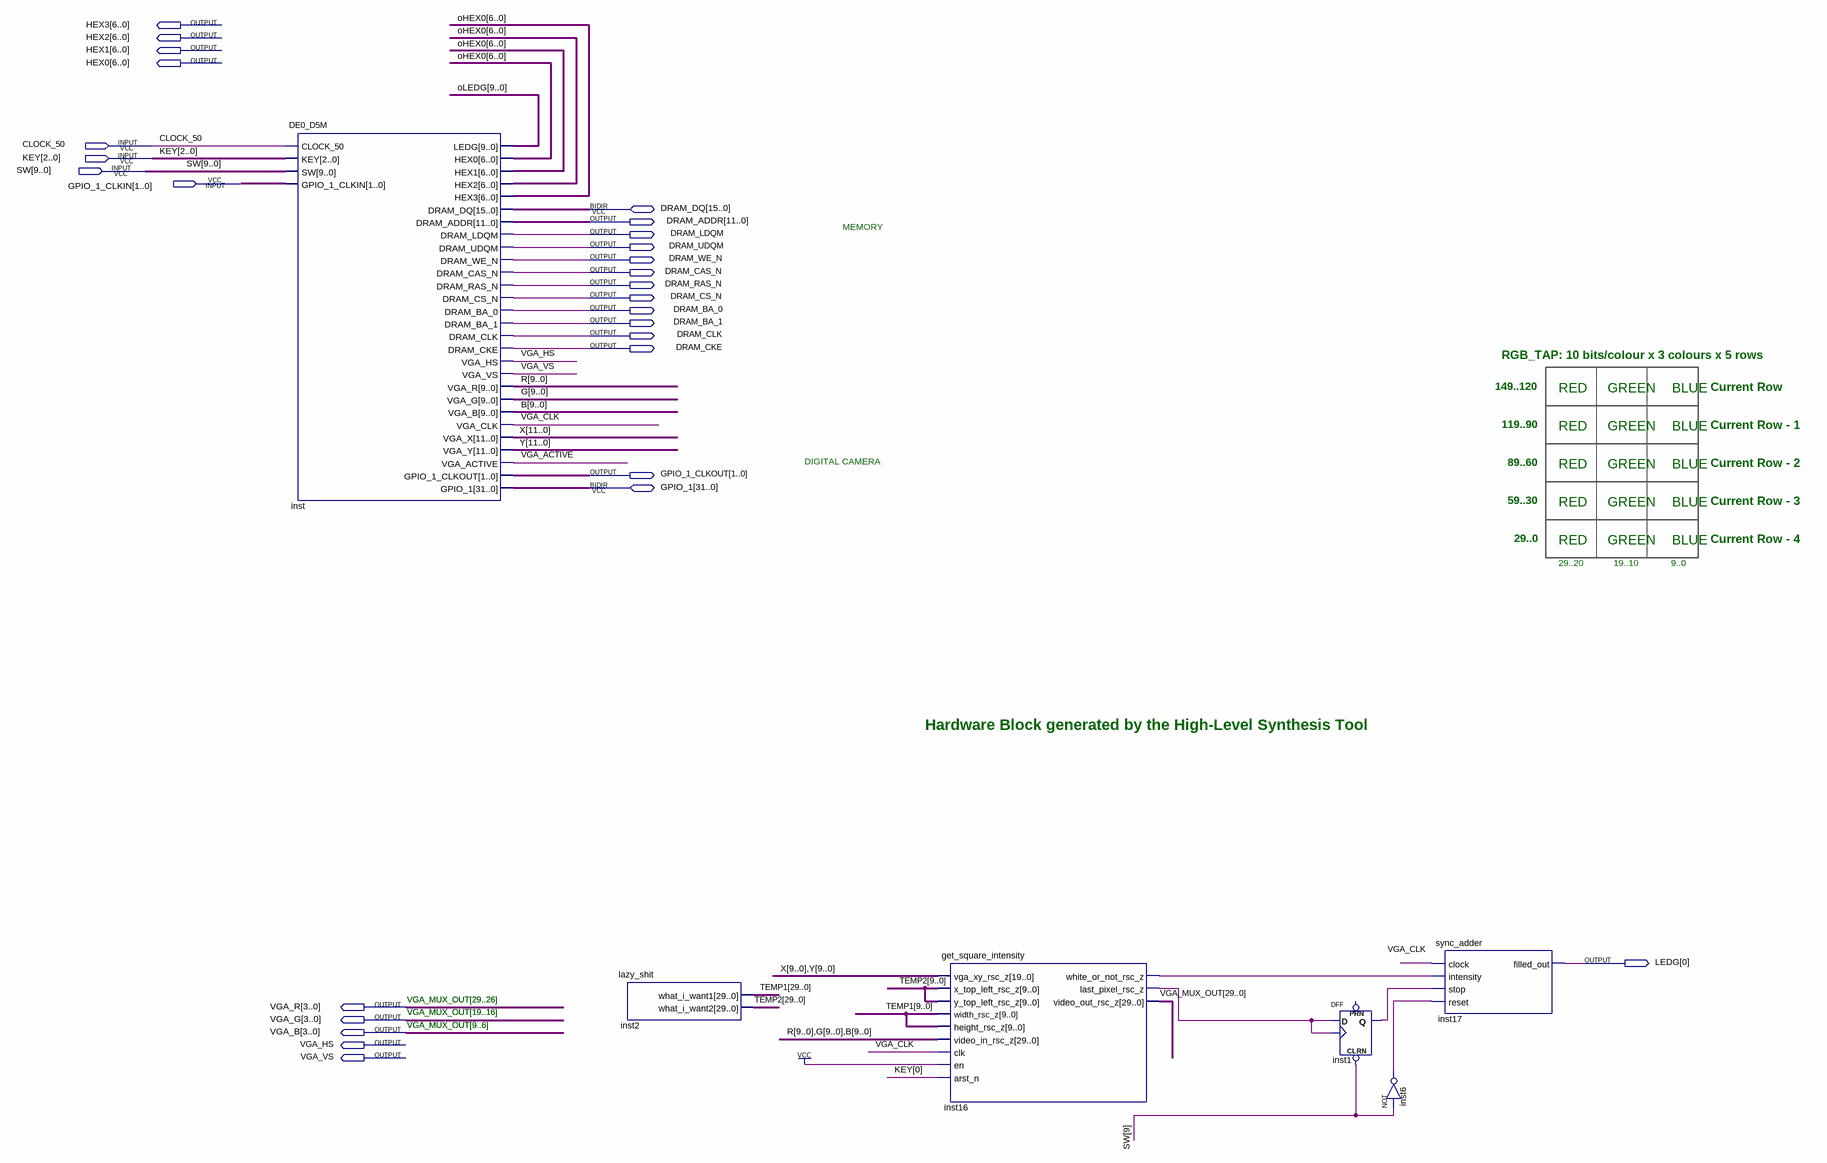
[diagram p0: schematic sheet]
// Quartus schematic TOP_DE0_CAMERA_MOUSE.bdf as structural Verilog: 6 symbols, 28 pins
module TOP_DE0_CAMERA_MOUSE (
  input  CLOCK_50,
  input  [2:0] KEY,
  input  [9:0] SW,
  input  [1:0] GPIO_1_CLKIN,
  inout  [15:0] DRAM_DQ,
  inout  [31:0] GPIO_1,
  output [6:0] HEX3,
  output [6:0] HEX2,
  output [6:0] HEX1,
  output [6:0] HEX0,
  output [11:0] DRAM_ADDR,
  output DRAM_LDQM,
  output DRAM_UDQM,
  output DRAM_WE_N,
  output DRAM_CAS_N,
  output DRAM_RAS_N,
  output DRAM_CS_N,
  output DRAM_BA_0,
  output DRAM_BA_1,
  output DRAM_CLK,
  output DRAM_CKE,
  output [1:0] GPIO_1_CLKOUT,
  output [0:0] LEDG,
  output [3:0] VGA_R,
  output [3:0] VGA_G,
  output [3:0] VGA_B,
  output VGA_HS,
  output VGA_VS
);

  wire inst1_q, inst6_out, inst16_last_pixel_rsc_z, inst16_white_or_not_rsc_z, VGA_ACTIVE, VGA_CLK;
  wire [6:0] oHEX0;
  wire [9:0] B, G, oLEDG, R;
  wire [11:0] X, Y;
  wire [25:0] VGA_MUX_OUT;
  wire [29:0] TEMP1, TEMP2;

  DE0_D5M inst (
    .CLOCK_50(CLOCK_50), .KEY(KEY), .SW(SW), .GPIO_1_CLKIN(GPIO_1_CLKIN), .LEDG(oLEDG), .HEX0(oHEX0),
    .HEX1(oHEX0), .HEX2(oHEX0), .HEX3(oHEX0), .DRAM_ADDR(DRAM_ADDR), .DRAM_LDQM(DRAM_LDQM),
    .DRAM_UDQM(DRAM_UDQM), .DRAM_WE_N(DRAM_WE_N), .DRAM_CAS_N(DRAM_CAS_N), .DRAM_RAS_N(DRAM_RAS_N),
    .DRAM_CS_N(DRAM_CS_N), .DRAM_BA_0(DRAM_BA_0), .DRAM_BA_1(DRAM_BA_1), .DRAM_CLK(DRAM_CLK),
    .DRAM_CKE(DRAM_CKE), .VGA_HS(VGA_HS), .VGA_VS(VGA_VS), .VGA_R(R), .VGA_G(G), .VGA_B(B),
    .VGA_CLK(VGA_CLK), .VGA_X(X), .VGA_Y(Y), .VGA_ACTIVE(VGA_ACTIVE), .GPIO_1_CLKOUT(GPIO_1_CLKOUT),
    .DRAM_DQ(DRAM_DQ), .GPIO_1(GPIO_1));
  lazy_shit inst2 (.what_i_want1(TEMP1), .what_i_want2(TEMP2));
  get_square_intensity inst16 (
    .vga_xy_rsc_z({X[9:0], Y[9:0]}), .x_top_left_rsc_z(TEMP2[9:0]), .y_top_left_rsc_z(TEMP2[9:0]),
    .width_rsc_z(TEMP1[9:0]), .height_rsc_z(TEMP1[9:0]), .video_in_rsc_z({R, G, B}), .clk(VGA_CLK),
    .en(1'b1), .arst_n(KEY[0]), .white_or_not_rsc_z(inst16_white_or_not_rsc_z),
    .last_pixel_rsc_z(inst16_last_pixel_rsc_z),
    .video_out_rsc_z({VGA_R, VGA_MUX_OUT[25:20], VGA_G, VGA_MUX_OUT[15:10], VGA_B, VGA_MUX_OUT[5:0]}));
  DFF inst1 (.CLRN(SW[9]), .CLK(inst16_last_pixel_rsc_z), .D(inst16_last_pixel_rsc_z), .Q(inst1_q));  // open: PRN
  not inst6 (inst6_out, SW[9]);
  sync_adder inst17 (
    .clock(VGA_CLK), .intensity(inst16_white_or_not_rsc_z), .stop(inst1_q), .reset(inst6_out),
    .filled_out(LEDG[0]));

  // Other names for the same wires on the sheet: VGA_MUX_OUT (some bits) = {VGA_R, VGA_G, VGA_B}

  // Notes on the sheet:
  //   MEMORY
  //   RGB_TAP: 10 bits/colour x 3 colours x 5 rows
  //   149..120
  //   RED     GREEN    BLUE
  //   Current Row
  //   119..90
  //   RED     GREEN    BLUE
  //   Current Row - 1
  //   DIGITAL CAMERA
  //   89..60
  //   RED     GREEN    BLUE
  //   Current Row - 2
  //   59..30
  //   RED     GREEN    BLUE
  //   Current Row - 3
  //   29..0
  //   RED     GREEN    BLUE
  //   Current Row - 4
  //   29..20            19..10             9..0
  //   Hardware Block generated by the High-Level Synthesis Tool
  //   VGA_MUX_OUT[29..26]
  //   VGA_MUX_OUT[19..16]
  //   VGA_MUX_OUT[9..6]
endmodule
